# EAGLE design TE-MS5837-breakout (EAGLE 9.3.0)
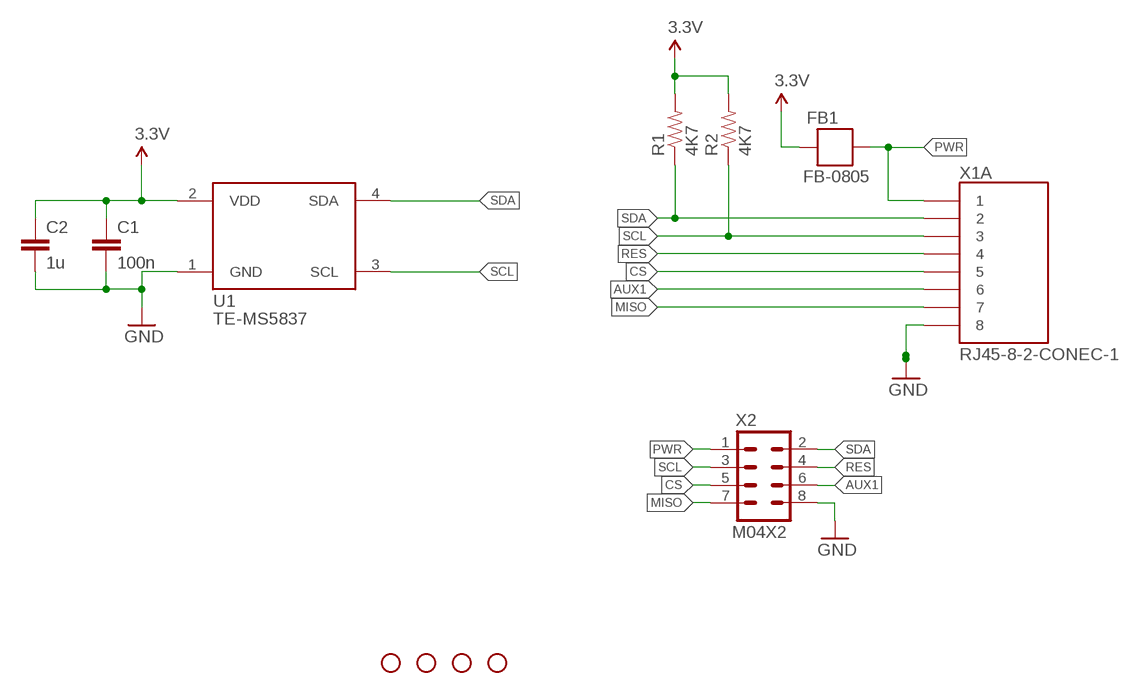
[diagram p0: schematic, sheet 1]

## Parts
C1  100n  CAP0805  [0805]
C2  1u  CAP0805  [0805]
FB1  FB-0805  [0805]
JP1  STAND-OFF  [STAND-OFF]
JP2  STAND-OFF  [STAND-OFF]
JP3  STAND-OFF  [STAND-OFF]
JP4  STAND-OFF  [STAND-OFF]
R1  4K7  RESISTOR0805-RES  [0805]
R2  4K7  RESISTOR0805-RES  [0805]
U1  TE-MS5837  [TE-MS5837]
X1  RJ45-8-2-CONEC-1  [CONEC-33TS3004ST-88001]
X2  M04X2  [2X4]

## Nets
3.3V: C1.1 C2.1 FB1.2 R1.2 R2.2 U1.2(VDD)
AUX1: X1.6 X2.6
CS: X1.5 X2.5
GND: C1.2 C2.2 U1.1(GND) X1.8 X1.M1 X1.M2 X2.8
MISO: X1.7 X2.7
PWR: FB1.1 X1.1 X2.1
RES: X1.4 X2.4
SCL: R2.1 U1.3(SCL) X1.3 X2.3
SDA: R1.1 U1.4(SDA) X1.2 X2.2

## Library data of the parts
C1 C2 = apollo-ctrl:CAP: Capacitor Standard 0603 ceramic capacitor, and 0.1" leaded capacitor.
FB1 = apollo-ctrl:FB
JP1-JP4 = apollo-ctrl:STAND-OFF: Stand Off This is the mechanical footprint for a #4 phillips button head screw. Use the keepout ring to avoid running the screw head into surrounding components. SKU : PRT-00447
R1 R2 = apollo-ctrl:RESISTOR: Resistor Basic schematic elements and footprints for 0603, 1206, and PTH resistors.
U1 = apollo-ctrl:TE-MS5837
X1 = apollo-ctrl:RJ45-8-2
X2 = apollo-ctrl:M04X2

## Board
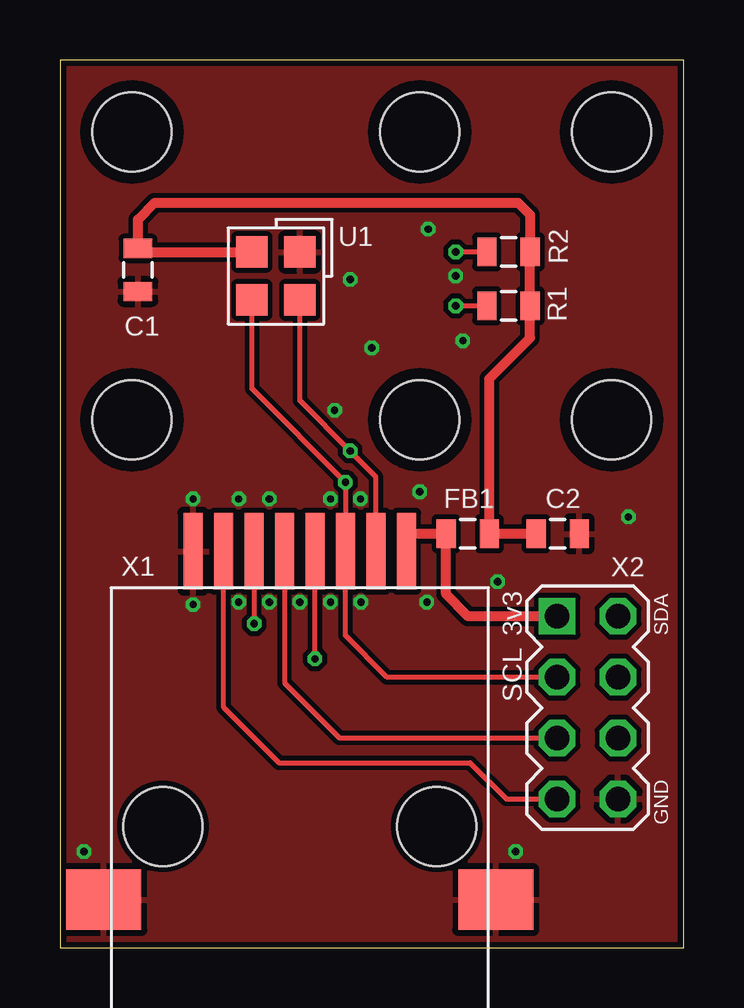
[diagram p1: board, top side]
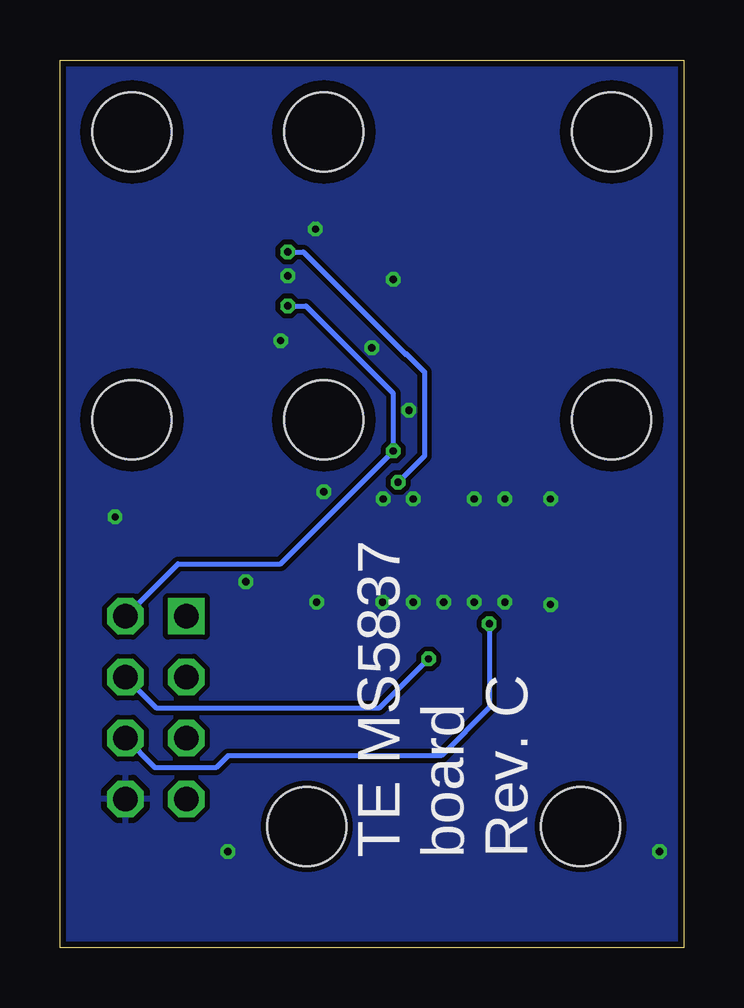
[diagram p2: board, bottom side, seen from below]

Size 26 x 37 mm. Coordinates in mm from the lower left corner, seen from the top.
Outline: 0,0 26,0 26,37 0,37 0,0
Copper layers (1*16): Top 0.035mm / dielectric 1.5mm / Bottom 0.035mm
Design rules "fusion-eagle-rule-tentedvias": minimum track width 6mil, minimum drill 0.3mm, track to track 6mil, track to pad 6mil, pad to pad 6mil, via to via 6mil, smd to smd 0mil, copper to edge 10mil, drill to drill 10mil, minimum pad ring 10mil, minimum via ring 6mil, stop-mask expansion 2mil, vias tented up to drill 25mil, thermal gap 10mil

### Footprints (pad centres in the part's own frame; a part is rotated, then mirrored left to right if it is on the bottom)
0805 = smd 0.8 x 1.2: 1 -0.9,0; 2 0.9,0
STAND-OFF = hole 3.302: 0,0
TE-MS5837 = smd 1.3 x 1.3: 1 1,-1; 2 1,1; 3 -1,1; 4 -1,-1
CONEC-33TS3004ST-88001 = smd 0.8 x 3.2: 1 -4.445,-14.52; 2 -3.175,-14.52; 3 -1.905,-14.52; 4 -0.635,-14.52; 5 0.635,-14.52; 6 1.905,-14.52; 7 3.175,-14.52; 8 4.445,-14.52 | smd 3.12 x 2.54: M1 -8.17,0; M2 8.17,0 | hole 3.3: -5.715,-3.05; 5.715,-3.05
2X4 = drill 1.016 square: 1 -3.81,-1.27 | drill 1.016 octagon: 2 -3.81,1.27; 3 -1.27,-1.27; 4 -1.27,1.27; 5 1.27,-1.27; 6 1.27,1.27; 7 3.81,-1.27; 8 3.81,1.27

### Placement (x,y rotation side)
C1  3.25,28.25 270 top
C2  20.75,17.25 0 top
FB1  17,17.25 0 top
JP1  3,34 0 top
JP2  15,34 0 top
JP3  3,22 0 top
JP4  15,22 0 top
JP5  STAND-OFF  [STAND-OFF]  23,34 0 top
JP6  STAND-OFF  [STAND-OFF]  23,22 0 top
R1  18.7,26.75 0 top
R2  18.7,29 0 top
U1  9,28 90 top
X1  10,2 180 top
X2  22,10 270 top

### Tracks (layer width: path | path; a pad name or v marks a point on that pad's centre or on a via)
3.3V
  Top 0.406: C2.1 FB1.2 17.9,23.71 19.6,25.41 R1.2 R2.2 19.6,30.55 19.1,31.05 3.95,31.05 3.25,30.35 C1.1 3.28,29 U1.2
AUX1  (via drill 0.3)
  Top 0.203: X1.6 v8.1,13.5
  Bottom 0.203: v8.1,13.5 8.1,10 10.1,8 19,8 19.5,7.5 22.04,7.5 X2.6
CS
  Top 0.203: X1.5 9.37,11.03 11.66,8.73 X2.5
GND  (via drill 0.3)
  other vias: 11.28,18.7 12.53,18.7 18.25,15.25 8.72,18.7 8.72,14.4 7.45,14.4 5.55,14.3 5.55,18.7 10,14.4 11.28,14.4 12.55,14.4 15,19 15.35,29.95 15.3,14.4 1,4 19,4 16.5,28 7.45,18.7 11.45,22.4 16.8,25.3 23.7,17.95 13,25 12.1,27.85
  pour Top (isolate 0.203): 0,0 26,0 26,37 0,37
  pour Bottom (isolate 0.203): 0,0 26,0 26,37 0,37
MISO
  Top 0.203: X2.7 18.61,6.19 17.1,7.7 9.13,7.7 6.83,10.01 X1.7
PWR
  Top 0.406: X1.1 14.45,17.25 FB1.1 16.1,14.73 17.02,13.81 X2.1
RES  (via drill 0.3)
  Top 0.203: v10.63,12.03 X1.4
  Bottom 0.203: X2.4 22,10 12.67,10 v10.63,12.03
SCL  (via drill 0.3)
  Top 0.203: R2.1 v16.5,29 | X2.3 13.64,11.27 11.9,13 X1.3 v11.9,19.39 8,23.3 U1.3
  Bottom 0.203: v16.5,29 15.85,29 11.55,24.7 11.55,24.75 10.8,24 10.8,20.5 v11.9,19.39
SDA  (via drill 0.3)
  Top 0.203: X1.2 13.18,19.62 v12.1,20.7 10,22.8 U1.4 | R1.1 v16.5,26.75
  Bottom 0.203: v16.5,26.75 15.75,26.75 12.1,23.1 v12.1,20.7 16.8,16 21.08,16 X2.2

### Text on the board
tNames: SDA | 3v3 | SCL | GND
bNames: TE MS5837 / board / Rev. C